# Altium schematic sheet PHY_LAN8720A.SchDoc: Ethernet
size A4; Date: 31 08 2013; Author: Rachid AKKOUCHE; CompanyName: MDI; DrawnBy: Rachid AKKOUCHE; Engineer: Rachid AKKOUCHE; Organization: RASoftware; Address1: 52 J03, rue de la crèche; Address2: 77100 MEAUX; Address3: FRANCE; DocumentNumber: BRA2013083011C; Revision: C; SheetNumber: 11; SheetTotal: 11; Telephone: +33651604047; Email: rachid.akkouche@wanadoo.fr; IsUserConfigurable: Y; Proprietaire: MDI System; Dessinepar: -; Verifiepar: -; Time: 16:56
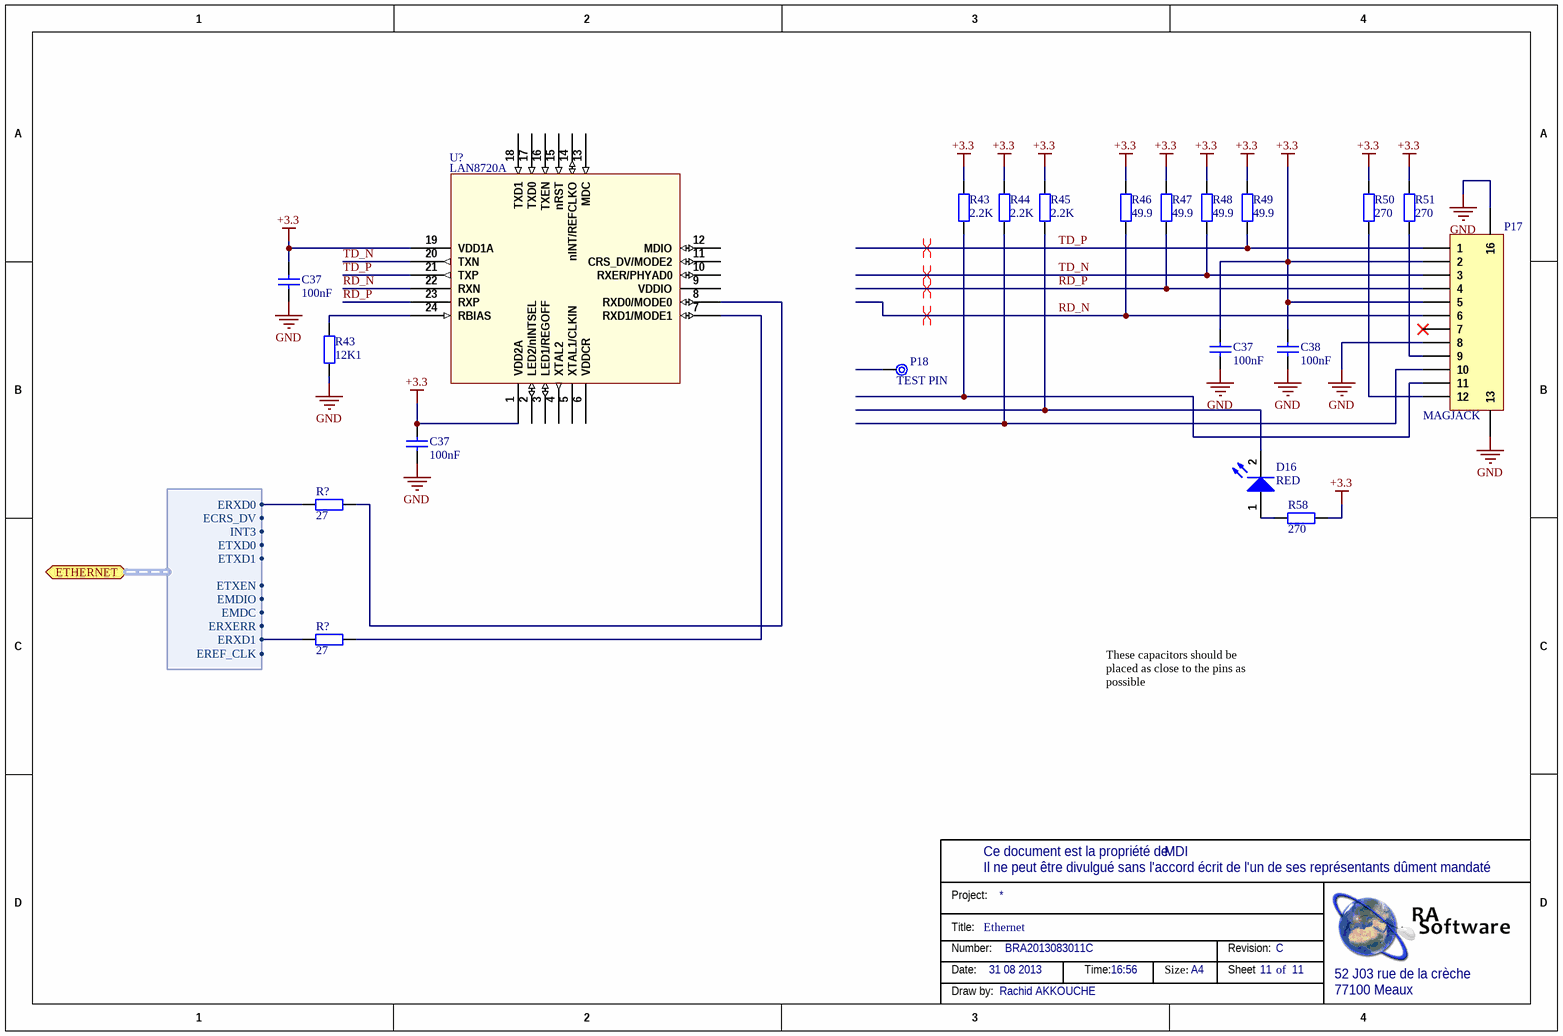
[diagram p0: PHY_LAN8720A.SchDoc]

## Parts
(Parts that share a designator on the sheet are numbered #1, #2 ... from top to bottom, then left to right.)
C37#1  100nF  [C0805]
C37#2  100nF  [C0805]
C37#3  100nF  [C0805]
C38  100nF  [C0805]
D16  Couleur: RED  [0603-LEDR]  (hidden comment: HSMH-C190)
P17  MAGJACK  [RJ45_8+LED]
P18  TEST PIN  [TP]
R43#1  2.2K  [R0805]
R43#2  12K1  [R0805]
R44  2.2K  [R0805]
R45  2.2K  [R0805]
R46  49.9  [R0805]
R47  49.9  [R0805]
R48  49.9  [R0805]
R49  49.9  [R0805]
R50  270  [R0805]
R51  270  [R0805]
R58  270  [R0805]
R?#1  27  [R0805]
R?#2  27  [R0805]
U?  LAN8720A

## Ports
ETHERNET (harness ETHERNET)

## Harnesses
ETHERNET: ETXEN, ETXD0, ETXD1, INT3, EMDIO, EMDC, ECRS_DV, ERXERR, ERXD0, ERXD1, EREF_CLK

## Nets
+3.3: C37#1.1 C37#2.1 C37#3.1 C38.1 P17.2 P17.5 R43#1.2 R44.2 R45.2 R46.2 R47.2 R48.2 R49.2 R50.2 R51.2 R58.1 U?.1(VDD2A) U?.19(VDD1A)
GND: C37#1.2 C37#2.2 C37#3.2 C38.2 P17.8 P17.13 P17.16 R43#2.1
RD_N: P17.6 R46.1 U?.22(RXN)
RD_P: P17.4 R47.1 U?.23(RXP)
TD_N: P17.3 R48.1 U?.20(TXN)
TD_P: P17.1 R49.1 U?.21(TXP)
NetD16_1: D16.1(A) R58.2
NetD16_2: D16.2(K) R45.1
NetP17_9: P17.9 R51.1
NetP17_10: P17.10 R44.1
NetP17_11: P17.11 R43#1.1
NetP17_12: P17.12 R50.1
NetR43#2_2: R43#2.2 U?.24(RBIAS)
NetR?#1_1: R?#1.1 U?.8(RXD0/MODE0)
NetR?#1_2: R?#1.2 ; port ETHERNET.ERXD0
NetR?#2_1: R?#2.1 U?.7(RXD1/MODE1)
NetR?#2_2: R?#2.2 ; port ETHERNET.ERXD1

Not connected (* = marked no-connect by the designer): P17 7*; P18 1; U? 2(LED2/nINTSEL) 3(LED1/REGOFF) 4(XTAL2) 5(XTAL1/CLKIN) 6(VDDCR) 9(VDDIO) 10(RXER/PHYAD0) 11(CRS_DV/MODE2) 12(MDIO) 13(MDC) 14(nINT/REFCLKO) 15(nRST) 16(TXEN) 17(TXD0) 18(TXD1)

## Layout directives
differential pair: RD_N, RD_P, TD_N, TD_P

## Notes on the sheet
- These capacitors should be placed as close to the pins as possible
- Ce document est la propriété de
- Project:
- Il ne peut être divulgué sans l'accord écrit de l'un de ses représentants dûment mandaté
- Title:
- Number:
- Date:
- Time:
- Size:
- A4
- Revision:
- Sheet
- of
- 52 J03 rue de la crèche
- Draw by:
- 77100 Meaux

## Library data of the parts
C37#1-C37#3 C38 = Cap 0805 100nF: Capacitor; Manufacturer: MULTICOMP; Manufacturer Part Number: MCCA000296; Supplier 1: Farnell; Supplier Part Number 1: 1759167; Pricing 1: 100=0,01, 500=0,008, 1000=0,006, 4000=0,005 (EUR); ComponentLink1URL: http://www.farnell.com/datasheets/1520827.pdf; ComponentLink1Description: http://www.farnell.com/datasheets/1520827.pdf
D16 = HSMH-C190: Surface Mount Chip LED, Red; Manufacturer: AVAGO TECHNOLOGIES; Manufacturer Part Number: HSMH-C190.; Taille de lampe: 0.8mm x 1; Couleur de LED: Rouge; Intensité lumineuse: 17; Angle, vision: 170°; Courant, direct, If: 20; Tension, direct à  If: 1.8; Montage LED: CMS; Forme de lentille: Rectangulaire; Longueur d'onde typ.: 626; SVHC: No SVHC (19-Dec-2012); Dissipation de puissance: 65; Intensité lumineuse min. à  If: 2.8; Intensité lumineuse typique: 10; Largeur (externe): 0.8; Longueur d'onde dominante: 639; Longueur d'onde, crête: 630; Longueur/hauteur: 1.6; Matière: AlGaAs; Nombre de broches: 2; Orientation de montage opto: Dessus; Orientation sortie de lumière: Top Emitting; Température de fonctionnement: -30°C à +85; Température de fonctionnement max..: 85; Température, stockage min.: -40; Température d'utilisation min: -30; Tension, Vf max..: 2.6; Tension, Vf min.: 2.1; Type de LED: Standard; Supplier 1: Farnell; Supplier Part Number 1: 8554641; RoHS: YES; Stock 1: 13902; Pricing 1: 5=0,06, 25=0,059, 100=0,057, 250=0,052, 500=0,047 (EUR); MSL: MSL 2A - 4 semaines; Couleur, LED: Rouge; Profondeur: 0.8; Température, stockage max..: 85; Tension, Vf typ.: 1.8; ComponentLink1URL: http://www.farnell.com/datasheets/313031.pdf; ComponentLink1Description: http://www.farnell.com/datasheets/313031.pdf; ComponentLink2URL: http://www.farnell.com/datasheets/55927.pdf; ComponentLink2Description: http://www.farnell.com/datasheets/55927.pdf
P17 = Header 12: Header, 12-Pin; Manufacturer: STEWART CONNECTOR; Manufacturer Part Number: SI-60062-F; LatestRevisionDate: 17-Jul-2002; LatestRevisionNote: Re-released for DXP Platform.; Publisher: Altium Limited; Supplier 1: Farnell; RoHS: YES; Stock 1: 1607; Pricing 1: 1=5,39, 10=5,07, 50=4,75, 100=4,65 (EUR); ComponentLink1URL: http://www.farnell.com/datasheets/1523782.pdf; ComponentLink1Description: http://www.farnell.com/datasheets/1523782.pdf; ComponentLink2URL: http://www.farnell.com/cad/1683659.pdf; ComponentLink2Description: http://www.farnell.com/cad/1683659.pdf; ComponentLink3URL: http://www.farnell.com/datasheets/79319.pdf; ComponentLink3Description: http://www.farnell.com/datasheets/79319.pdf; Supplier Part Number 1: 1137983
R43#1 R44 R45 = Resistor 0805 2.2K: Resistor; Manufacturer: MULTICOMP; Manufacturer Part Number: MC01W080512K2; Supplier 1: Farnell; RoHS: YES; Pricing 1: 5000=0,001 (EUR); ComponentLink1URL: http://www.farnell.com/datasheets/1729047.pdf; ComponentLink1Description: http://www.farnell.com/datasheets/1729047.pdf; Supplier Part Number 1: 2129138
R43#2 = Resistor 0805 2.2K: Resistor
R46-R49 = Resistor 0805 49.9: Resistor; Manufacturer: MULTICOMP; Manufacturer Part Number: MC01W0805149R9; Product Range: MULTICOMP - MC Series; Puissance: 100; Tolérance de résistance: ± 1%; Type de boîtier de résistance: 0805; Type de résistance: Couche épaisse; Coefficient de température: ± 200; Tension: 150; Type de packaging: Full Reel; SVHC: No SVHC (20-Jun-2013); Resistor Mounting: CMS; Supplier 1: Farnell; RoHS: YES; Pricing 1: 5000=0,001 (EUR); Résistance: 49.9; MSL: (Non Applicable); ComponentLink1URL: http://www.farnell.com/datasheets/1729047.pdf; ComponentLink1Description: http://www.farnell.com/datasheets/1729047.pdf; Supplier Part Number 1: 2129011
R50 R51 = Resistor 0805 270: Resistor; Manufacturer: MULTICOMP; Manufacturer Part Number: MC01W08051270R; Product Range: MULTICOMP - MC Series; Puissance: 100; Tolérance de résistance: ± 1%; Type de boîtier de résistance: 0805; Type de résistance: Couche épaisse; Coefficient de température: ± 100; Tension: 150; Type de packaging: Full Reel; SVHC: No SVHC (20-Jun-2013); Resistor Mounting: CMS; Supplier 1: Farnell; Supplier Part Number 1: 2129067; RoHS: YES; Pricing 1: 5000=0,001 (EUR); Résistance: 270; MSL: -; ComponentLink1URL: http://www.farnell.com/datasheets/1729047.pdf; ComponentLink1Description: http://www.farnell.com/datasheets/1729047.pdf
R58 = Resistor 0805 1K: Resistor; Manufacturer: MULTICOMP; Manufacturer Part Number: MC01W08051270R; Product Range: MULTICOMP - MC Series; Puissance: 100; Tolérance de résistance: ± 1%; Type de boîtier de résistance: 0805; Type de résistance: Couche épaisse; Coefficient de température: ± 100; Tension: 150; Type de packaging: Full Reel; SVHC: No SVHC (20-Jun-2013); Resistor Mounting: CMS; Supplier 1: Farnell; Supplier Part Number 1: 2129067; RoHS: YES; Pricing 1: 5000=0,001 (EUR); Résistance: 270; MSL: -; ComponentLink1URL: http://www.farnell.com/datasheets/1729047.pdf; ComponentLink1Description: http://www.farnell.com/datasheets/1729047.pdf
R?#1 R?#2 = Resistor 0805 56: Resistor; Manufacturer: MULTICOMP; Coefficient de température: ± 200; ComponentLink1URL: http://www.farnell.com/datasheets/1729047.pdf; ComponentLink1Description: http://www.farnell.com/datasheets/1729047.pdf